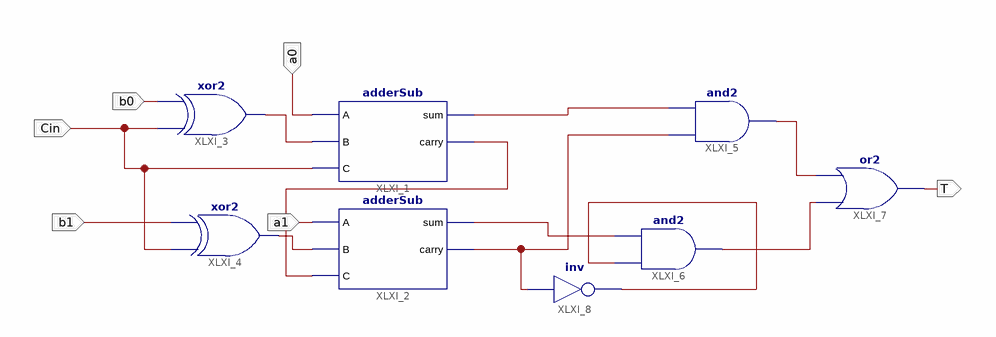
[diagram p0: schematic sheet 1]
// Xilinx ISE schematic prime.sch (artix7) as structural Verilog: 8 symbols, 6 ports
module prime (
  input  b0,
  input  b1,
  input  a0,
  input  a1,
  input  Cin,
  output T
);

  wire XLXN_1, XLXN_2, XLXN_3, XLXN_15, XLXN_22, XLXN_23, XLXN_24, XLXN_27, XLXN_28;

  adderSub XLXI_1 (.A(a0), .B(XLXN_1), .C(Cin), .carry(XLXN_3), .sum(XLXN_22));
  adderSub XLXI_2 (.A(a1), .B(XLXN_2), .C(XLXN_3), .carry(XLXN_27), .sum(XLXN_15));
  xor XLXI_3 (XLXN_1, Cin, b0);
  xor XLXI_4 (XLXN_2, Cin, b1);
  and XLXI_5 (XLXN_23, XLXN_27, XLXN_22);
  and XLXI_6 (XLXN_24, XLXN_28, XLXN_15);
  or XLXI_7 (T, XLXN_24, XLXN_23);
  not XLXI_8 (XLXN_28, XLXN_27);
endmodule
